# Altium project Projekt_Kolibri_FixBoard.PrjPcb
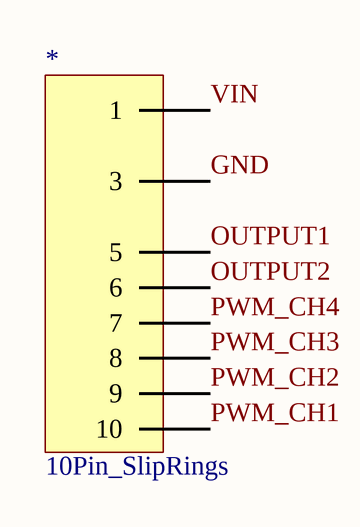
[diagram p0: FixBoard.SchDoc]
1 sheet, 1 parts. Net scope: global (net labels, ports and power ports of the same name join across sheets).
Board file: FixBoard.PcbDoc

## Sheet FixBoard.SchDoc
size A3; SheetNumber: 1; SheetTotal: 1

### Parts
*  10Pin_SlipRings  [10Pin_SlipRings]

### Nets
GND: *.3
OUTPUT1: *.5
OUTPUT2: *.6
PWM_CH1: *.10
PWM_CH2: *.9
PWM_CH3: *.8
PWM_CH4: *.7
VIN: *.1